# Altium schematic sheet ADC.SchDoc
size A
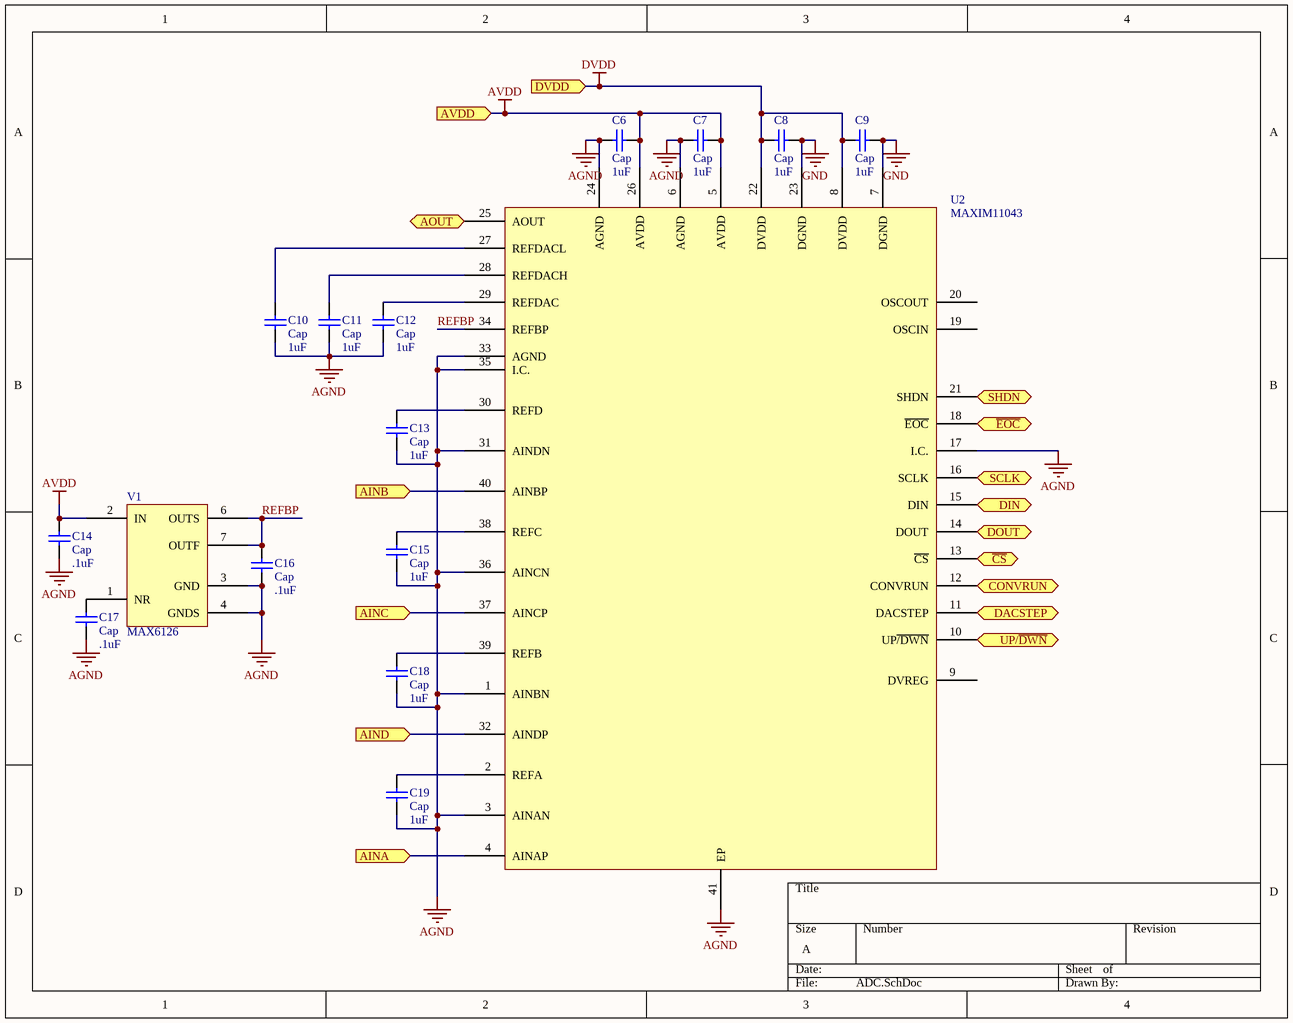
[diagram p0: ADC.SchDoc]

## Parts
C6  Cap  value 1uF  [1608[0603]]
C7  Cap  value 1uF  [1608[0603]]
C8  Cap  value 1uF  [1608[0603]]
C9  Cap  value 1uF  [1608[0603]]
C10  Cap  value 1uF  [1608[0603]]
C11  Cap  value 1uF  [1608[0603]]
C12  Cap  value 1uF  [1608[0603]]
C13  Cap  value 1uF  [1608[0603]]
C14  Cap  value .1uF  [1608[0603]]
C15  Cap  value 1uF  [1608[0603]]
C16  Cap  value .1uF  [1608[0603]]
C17  Cap  value .1uF  [1608[0603]]
C18  Cap  value 1uF  [1608[0603]]
C19  Cap  value 1uF  [1608[0603]]
U2  MAXIM11043  [21-0141I_T406600]
V1  MAX6126  [SOIC127P600X175-8N(lm358)]

## Ports
AINA (in), AINB (in), AINC (in), AIND (in), AOUT (out), AVDD (in), CONVRUN (in), DACSTEP (in), DIN (in), DOUT (out), DVDD (in), SCLK (in), SHDN (in), UP/~{DWN}, ~{CS} (out), ~{EOC} (out)

## Nets
AGND: C6.1 C7.1 C10.1 C11.1 C12.1 C13.1 C14.1 C15.1 C16.1 C17.1 C18.1 C19.1 U2.1(AINBN) U2.3(AINAN) U2.6(AGND) U2.17(I.C.) U2.24(AGND) U2.31(AINDN) U2.33(AGND) U2.35(I.C.) U2.36(AINCN) U2.41(EP) V1.3(GND) V1.4(GNDS)
AVDD: C6.2 C7.2 C14.2 U2.5(AVDD) U2.26(AVDD) V1.2(IN) ; port AVDD
DVDD: C8.1 C9.1 U2.8(DVDD) U2.22(DVDD) ; port DVDD
GND: C8.2 C9.2 U2.7(DGND) U2.23(DGND)
AINA: U2.4(AINAP) ; port AINA
AINB: U2.40(AINBP) ; port AINB
AINC: U2.37(AINCP) ; port AINC
AIND: U2.32(AINDP) ; port AIND
AOUT: U2.25(AOUT) ; port AOUT
~{CS}: U2.13(~{CS}) ; port ~{CS}
CONVRUN: U2.12(CONVRUN) ; port CONVRUN
DACSTEP: U2.11(DACSTEP) ; port DACSTEP
DIN: U2.15(DIN) ; port DIN
DOUT: U2.14(DOUT) ; port DOUT
~{EOC}: U2.18(~{EOC}) ; port ~{EOC}
REFBP: C16.2 U2.34(REFBP) V1.6(OUTS) V1.7(OUTF)
SCLK: U2.16(SCLK) ; port SCLK
SHDN: U2.21(SHDN) ; port SHDN
UP/~{DWN}: U2.10(UP~{/DWN}) ; port UP/~{DWN}
NetC10_2: C10.2 U2.27(REFDACL)
NetC11_2: C11.2 U2.28(REFDACH)
NetC12_2: C12.2 U2.29(REFDAC)
NetC13_2: C13.2 U2.30(REFD)
NetC15_2: C15.2 U2.38(REFC)
NetC17_2: C17.2 V1.1(NR)
NetC18_2: C18.2 U2.39(REFB)
NetC19_2: C19.2 U2.2(REFA)

Not connected (* = marked no-connect by the designer): U2 9(DVREG) 19(OSCIN) 20(OSCOUT)

## Library data of the parts
C6-C19 = Cap: Capacitor; Published: 8-Jun-2000; LatestRevisionDate: 17-Jul-2002; LatestRevisionNote: Re-released for DXP Platform.; PackageReference: RAD-0.3; Publisher: Altium Limited; PackageDescription: Radial Cap, Thru-Hole; 2 Leads; 0.3 in Pin Spacing